# Altium schematic sheet uart_console.SchDoc
size A4; SheetNumber: 16; SheetTotal: 21
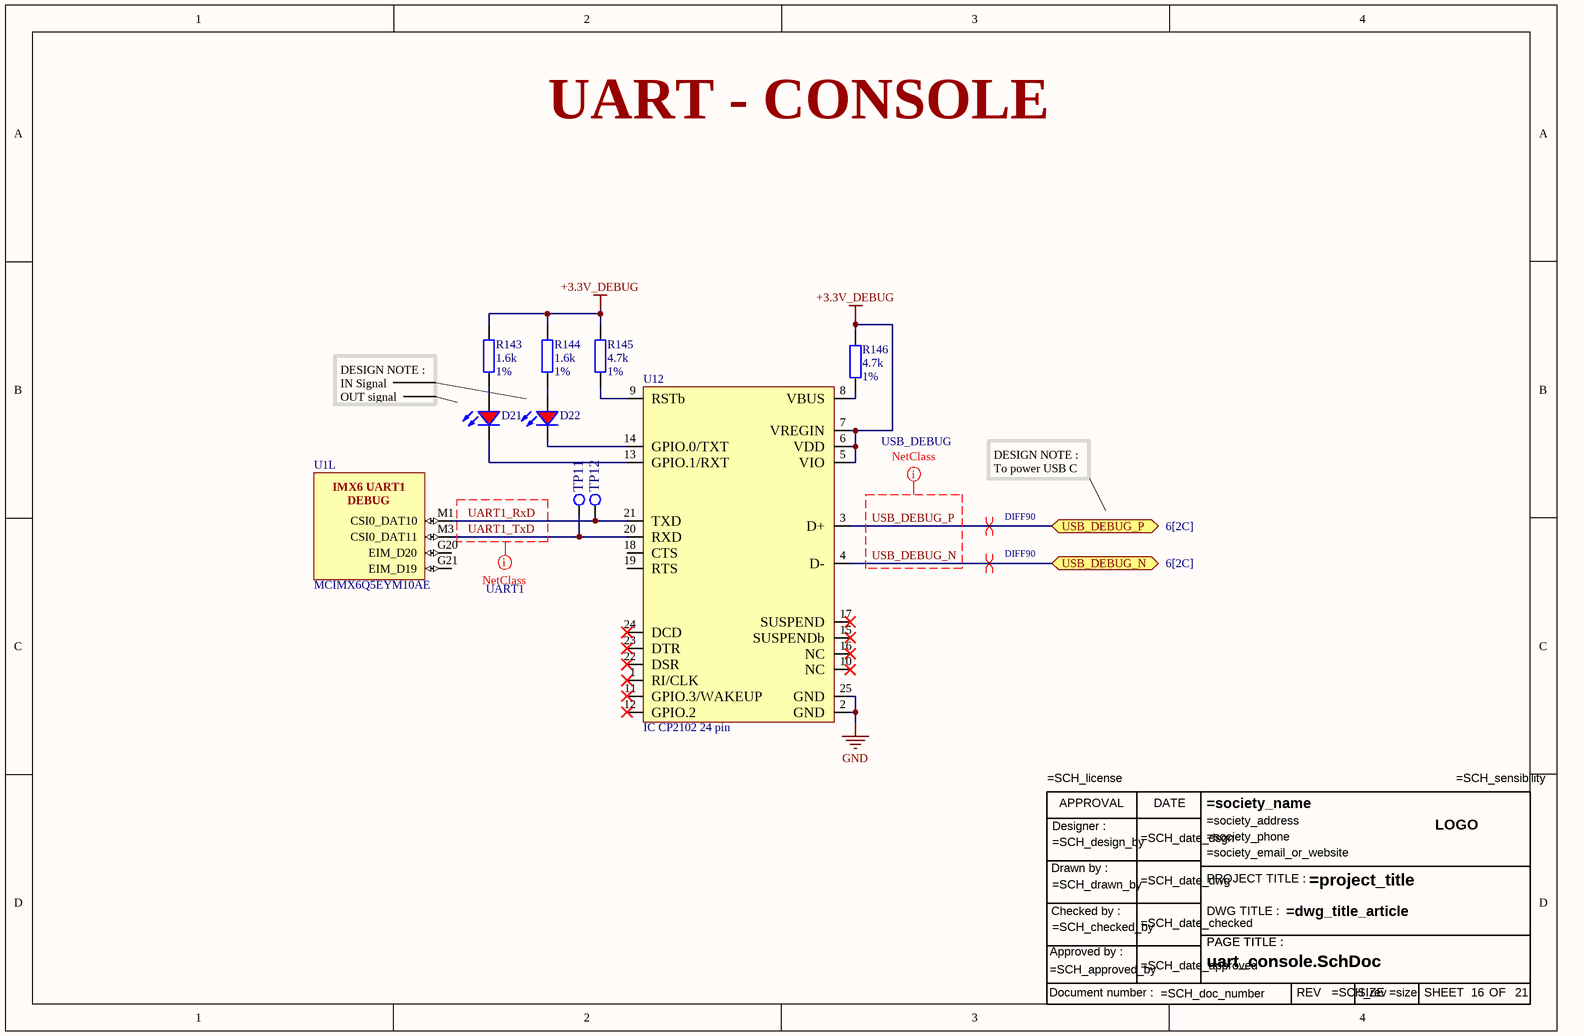
[diagram p0: uart_console.SchDoc]

## Parts
D21  Red, 2V, 120deg  [LED red 0603]  (value not drawn)
D22  Red, 2V, 120deg  [LED red 0603]  (value not drawn)
R143  1.6k  pourcentage: 1%  [Res 0402/1005]
R144  1.6k  pourcentage: 1%  [Res 0402/1005]
R145  4.7k  pourcentage: 1%  [Res 0402/1005]
R146  4.7k  pourcentage: 1%  [Res 0402/1005]
TB15  Title bloc ANSI modified  (value not drawn)
TP11  Test Point  [testpoint 1mm]  (value not drawn)
TP12  Test Point  [testpoint 1mm]  (value not drawn)
U1  MCIMX6Q5EYM10AE  [FRES-2197-01]  (part L of 21)
U12  IC CP2102 24 pin  [QFN24]

## Ports
USB_DEBUG_N (bidir, see 6[2C]), USB_DEBUG_P (bidir, see 6[2C])

## Nets
+3.3V_DEBUG: R143.2 R144.2 R145.2 R146.2 U12.5(VIO) U12.6(VDD) U12.7(VREGIN)
GND: U12.2(GND) U12.25(GND)
UART1_RxD: TP12.1(tp) U1.M1(CSI0_DAT10) U12.21(TXD)
UART1_TxD: TP11.1(tp) U1.M3(CSI0_DAT11) U12.20(RXD)
USB_DEBUG_N: U12.4(D-) ; port USB_DEBUG_N
USB_DEBUG_P: U12.3(D+) ; port USB_DEBUG_P
NetD21_1: D21.1(K) U12.13(GPIO.1/RXT)
NetD21_2: D21.2(A) R143.1
NetD22_1: D22.1(K) U12.14(GPIO.0/TXT)
NetD22_2: D22.2(A) R144.1
NetR145_1: R145.1 U12.9(RSTb)
NetR146_1: R146.1 U12.8(VBUS)

Not connected (* = marked no-connect by the designer): U1 G20(EIM_D20) G21(EIM_D19); U12 1(RI/CLK)* 10(NC)* 11(GPIO.3/WAKEUP)* 12(GPIO.2)* 15(SUSPENDb)* 16(NC)* 17(SUSPEND)* 18(CTS) 19(RTS) 22(DSR)* 23(DTR)* 24(DCD)*

## Layout directives
net class UART1: UART1_RxD, UART1_TxD
net class USB_DEBUG: USB_DEBUG_N, USB_DEBUG_P
differential pair; differential pair class DIFF90: USB_DEBUG_N, USB_DEBUG_P

## Notes on the sheet
- UART - CONSOLE
- DESIGN NOTE :
  IN Signal
  OUT signal
- DESIGN NOTE :
  To power USB C
- (in symbol IMX6Q5EYM10AE, part L) IMX6 UART1 / DEBUG
- (in symbol Title bloc ANSI) APPROVAL; DATE; Designer :; LOGO; Drawn by :; PROJECT TITLE :; Checked by :; DWG TITLE :; PAGE TITLE :; Approved by :; Document number :; REV; SIZE; SHEET; OF

## Library data of the parts
D21 D22 = LED Red 0603: WL-SMCC SMD Mono-color Chip LED Compact, size 0603, Red, 2V, 120deg 150060RS73220; Dominant Wavelength: 624nm; Luminous Intensity: 90mcd; Peak Wavelength: 632nm; Chip Technology: AlInGaP; ComponentLink1URL: http://www.we-online.de; ComponentLink2Description: Datasheet; ComponentLink2URL: https://katalog.we-online.com/led/datasheet/150060RS73220.pdf; Part Number: 150060RS73220; Published Date: July 2019; Publisher: Wurth Elektronik; Size: 0603; Viewing Angle: 120deg; Packaging: Tape and Reel; Emitting Color: Red; Mounting Technology: SMT; Forward Voltage: 2V; Operating Temperature: -40 to +85degC
R143 R144 = res 1.6k 1%: res 1.6k 1% 0402
R145 R146 = res 4.7k 1%: res 4.7k 1% 0402
TB15 = Title bloc ANSI
TP11 TP12 = Test Point: Test point 1mm diameter
U1 = IMX6Q5EYM10AE: 32-Bit i.MX 6 Quad Application Processor, 1 GHz, 256 KB RAM, Extended Consumer Grade, 624-Pin FCPBGA, RoHS, Tape and Reel; PartNumber: MCIMX6Q5EYM10ACR; Manufacturer: Freescale Semiconductor; CAN: FlexCAN; Number of Cores: 4 Spec; External Memory Supported: DDR3, DDR3L, FLASH, LPDDR2; Speed Grade: 1 GHz; Core Type: ARM Cortex A9; Cache (KB): 32; Ethernet: 1 Gbps + IEEE 1588; Internal RAM (KB): 256; ComponentLink1Description: Manufacturer URL; ComponentLink2Description: Datasheet; DatasheetVersion: Rev. 2.3; ComponentLink3URL: http://cache.freescale.com/files/32bit/doc/data_sheet/IMX6DQCEC.pdf?fpsp=1&WT_TYPE=Data%20Sheets&WT_VENDOR=FREESCALE&WT_FILE_FORMAT=pdf&WT_ASSET=Documentation; ComponentLink1URL: http://www.freescale.com/; Packing: Tape and Reel; Temperature Range: -20 to 105 degC; ComponentLink2URL: http://cache.freescale.com/files/32bit/doc/data_sheet/IMX6DQCEC.pdf?fpsp=1&WT_TYPE=Data%20Sheets&WT_VENDOR=FREESCALE&WT_FILE_FORMAT=pdf&WT_ASSET=Documentation; ComponentLink3Description: Package Specification; PackageVersion: Rev. A; RoHS: TRUE; Quad/Dual CPU: i.MX 6Quad; Mounting Technology: Surface Mount; PackageReference: FCPBGA-624; PackageDescription: 624-pin Ball Grid Array Package, Body 21 x 21mm, Pitch 0.8mm
U12 = IC CP2102 24 pin: UART to USB converter